# Altium project PICC.PrjPCB
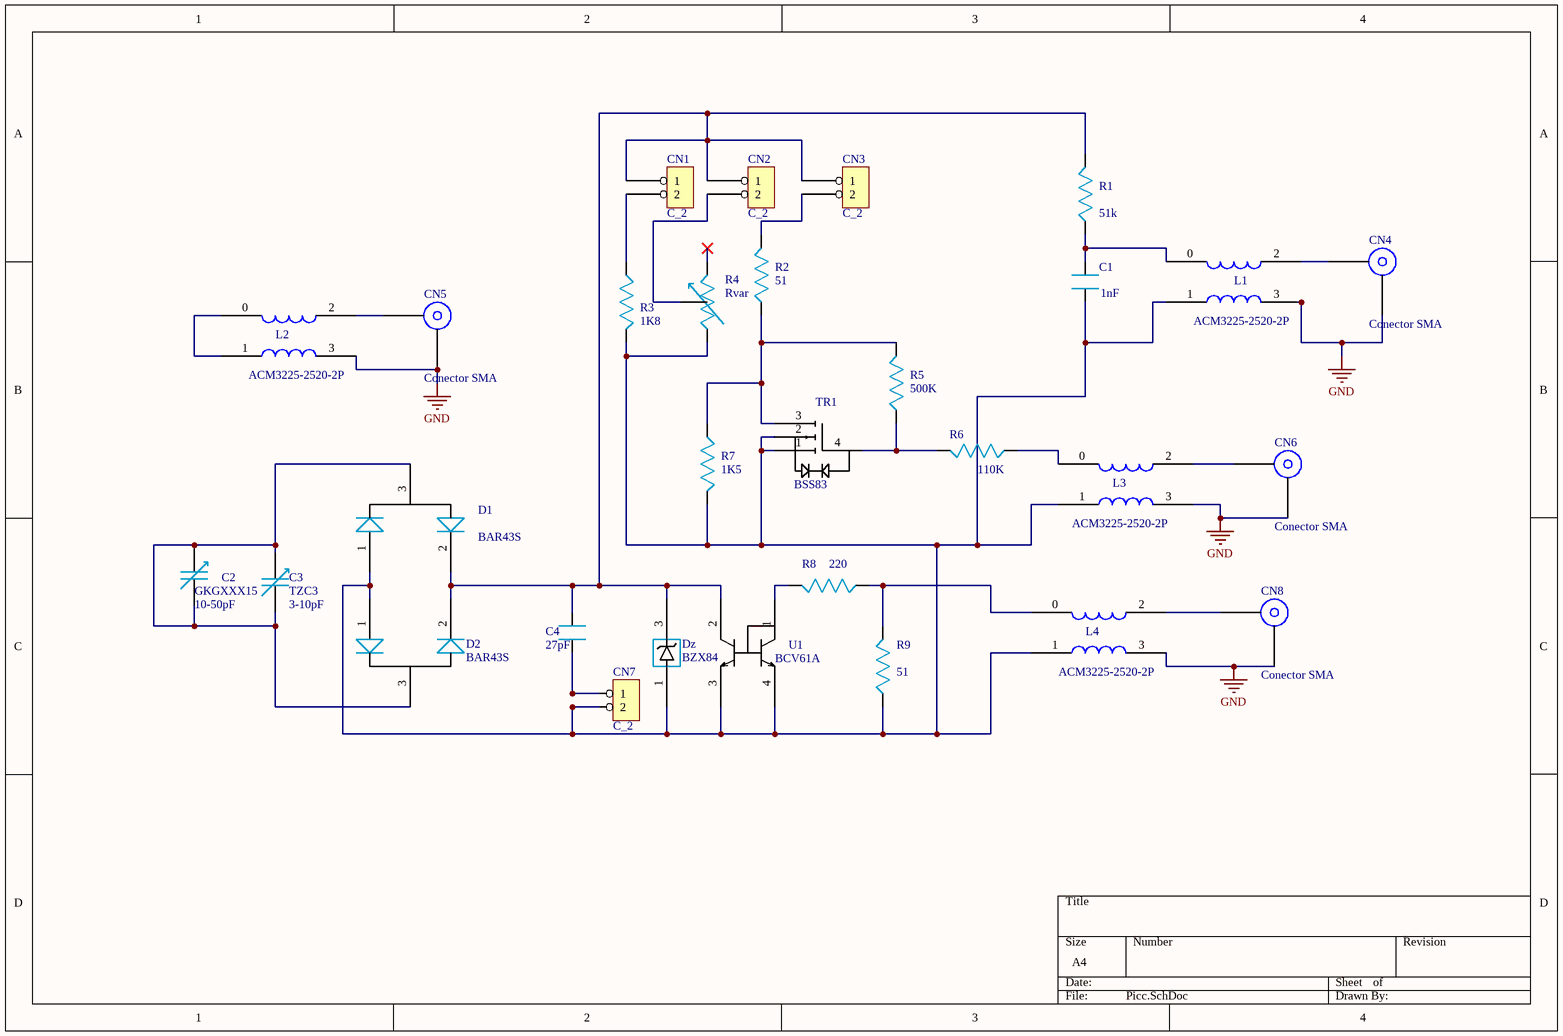
[diagram p0: Picc.SchDoc]
1 sheet, 30 parts. Net scope: global (net labels, ports and power ports of the same name join across sheets).
Board file: PCB1.PcbDoc

## Sheet Picc.SchDoc
size A4

### Parts
C1  1nF  [C_1210]
C2  GKGXXX15  [GKGXXX15]
C3  TZC3  [TZC3]
C4  27pF  [C_1210]
CN1  C_2  [2x1 Pin Array]
CN2  C_2  [2x1 Pin Array]
CN3  C_2  [2x1 Pin Array]
CN4  Conector SMA  [Conector SMA]
CN5  Conector SMA  [Conector SMA]
CN6  Conector SMA  [Conector SMA]
CN7  C_2  [2x1 Pin Array]
CN8  Conector SMA  [Conector SMA]
D1  BAR43S  [BAR43S]
D2  BAR43S  [BAR43S]
Dz  BZX84  [BZX84]
L1  ACM3225-2520-2P  [ACM3225.2520-2P]
L2  ACM3225-2520-2P  [ACM3225.2520-2P]
L3  ACM3225-2520-2P  [ACM3225.2520-2P]
L4  ACM3225-2520-2P  [ACM3225.2520-2P]
R1  51k  [R_1210]
R2  51  [R_1210]
R3  1K8  [R_1210]
R4  Rvar  [Bourns 3224W]
R5  500K  [R_1210]
R6  110K  [R_1210]
R7  1K5  [R_1210]
R8  220  [R_1210]
R9  51  [R_1210]
TR1  BSS83  [BSS83]
U1  BCV61A  [BCV61A]

### Nets
GND: CN4.1 CN5.1 CN6.1 CN8.1 L1.3 L2.3 L3.3 L4.3
NetC1_1: C1.1 CN7.2 D1.1 D2.1 Dz.1 L1.1 L3.1 L4.1 R3.2 R4.1 R7.2 R9.1 TR1.1(s) TR1.2(b) U1.3 U1.4
NetC1_2: C1.2 L1.0 R1.1
NetC2_0: C2.0 C2.1 C3.0 C3.1 D1.3 D2.3
NetC4_1: C4.1 CN7.1
NetC4_2: C4.2 CN1.1 CN2.1 CN3.1 D1.2 D2.2 Dz.3 R1.2 U1.2
NetCN1_2: CN1.2 R3.1
NetCN2_2: CN2.2 R4.3
NetCN3_2: CN3.2 R2.2
NetCN4_0: CN4.0 L1.2
NetCN5_0: CN5.0 L2.2
NetCN6_0: CN6.0 L3.2
NetCN8_0: CN8.0 L4.2
NetL2_0: L2.0 L2.1
NetL3_0: L3.0 R6.1
NetL4_0: L4.0 R8.1 R9.2
NetR2_1: R2.1 R5.2 R7.1 TR1.3(d)
NetR5_1: R5.1 R6.2 TR1.4(g)
NetR8_2: R8.2 U1.1

Not connected (* = marked no-connect by the designer): R4 2*

### Notes on the sheet
- (in symbol GKGXXX15) 10-50pF
- (in symbol TZC3) 3-10pF

### Library data of the parts
C1 C4 = Cap: Ceramic Capacitor
C2 = GKGXXX15: 10
CN1-CN3 CN7 = C_2: Conector 2 pines
CN4-CN6 CN8 = Conector SMA: Conector 2 pines
R1-R3 R5-R9 = R: Chip Resistor
R4 = Rvar: SMD Potentiometer